# Altium schematic sheet BACKUP_POWER_充电升压俩芯片.SchDoc
size A4
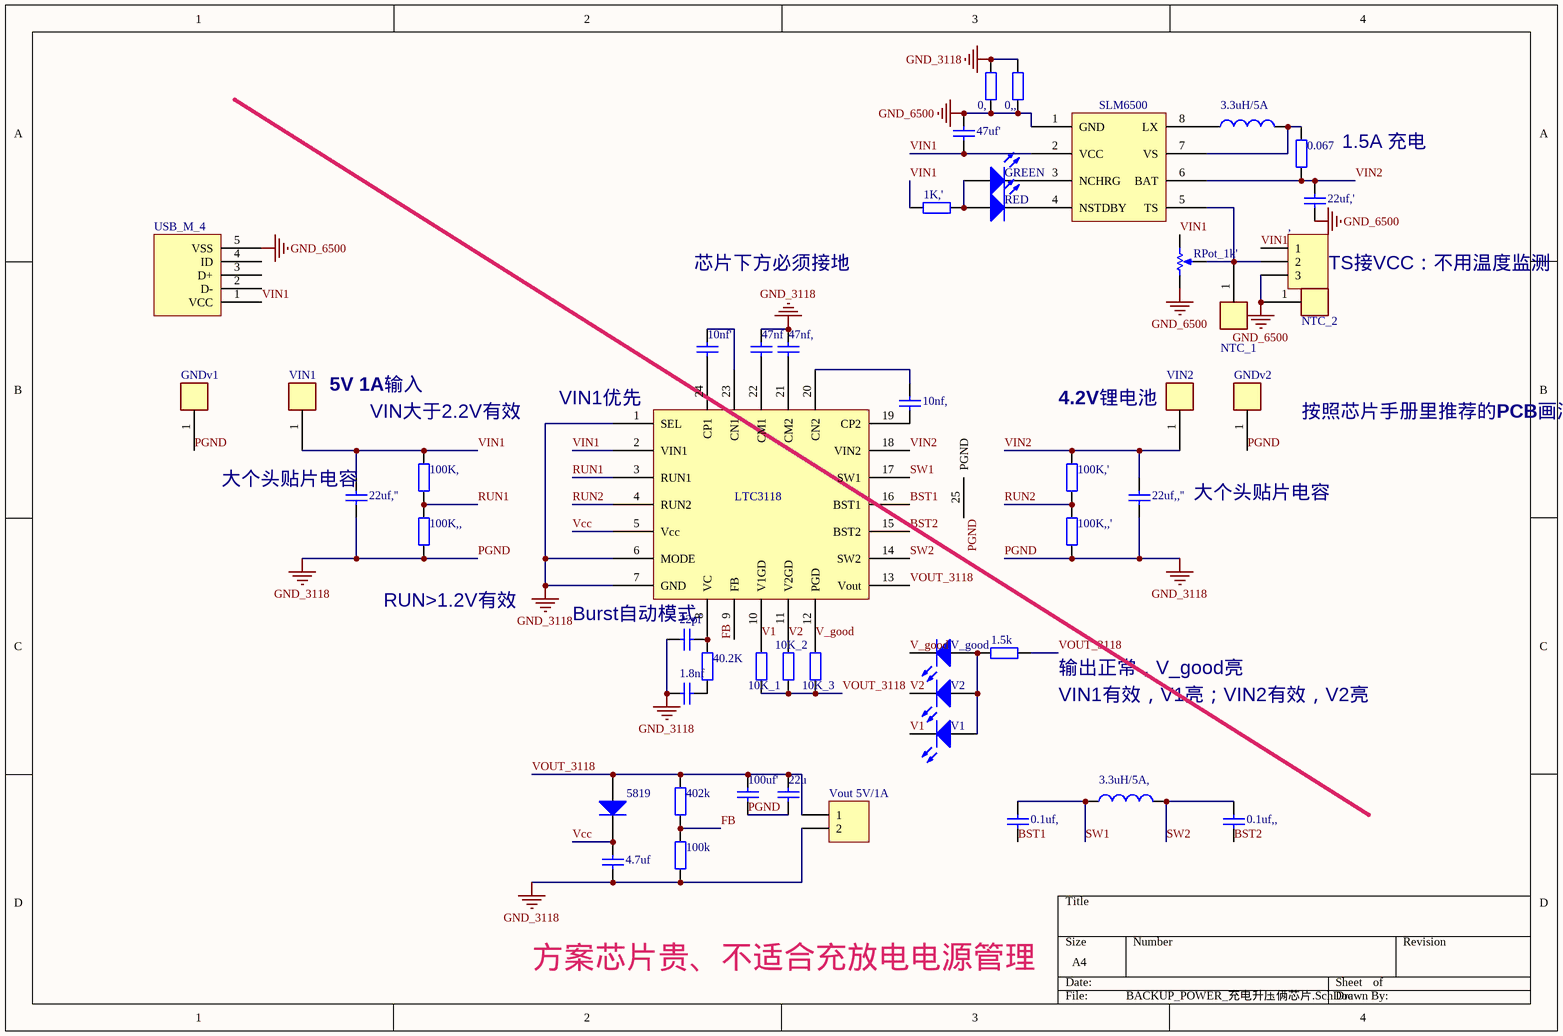
[diagram p0: BACKUP_POWER_充电升压俩芯片.SchDoc]

## Parts
0,  Res2  [0805A]  (value not drawn)
0,,  Res2  [0805A]  (value not drawn)
0.1uf,  Cap  [C-RAD-0805]  (value not drawn)
0.1uf,,  Cap  [C-RAD-0805]  (value not drawn)
0.067  Res2  [1206R]  (value not drawn)
1.5k  Res2  [0805A]  (value not drawn)
1.8nf  Cap  [C-RAD-0805]  (value not drawn)
1K,'  Res2  [0805A]  (value not drawn)
3.3uH/5A  Inductor  [6 X 6-L]  (value not drawn)
3.3uH/5A,  Inductor  [6 X 6-L]  (value not drawn)
4.7uf  Cap  [C-RAD-0805]  (value not drawn)
10K_1  Res2  [0805A]  (value not drawn)
10K_2  Res2  [0805A]  (value not drawn)
10K_3  Res2  [0805A]  (value not drawn)
10nf'  Cap  [C-RAD-0805]  (value not drawn)
10nf,  Cap  [C-RAD-0805]  (value not drawn)
22pf  Cap  [C-RAD-0805]  (value not drawn)
22u  Cap  [1812]  (value not drawn)
22uf,'  Cap  [C-RAD-0805]  (value not drawn)
22uf,''  Cap  [1812]  (value not drawn)
22uf,,''  Cap  [1812]  (value not drawn)
40.2K  Res2  [0805A]  (value not drawn)
47nf  Cap  [C-RAD-0805]  (value not drawn)
47nf,  Cap  [C-RAD-0805]  (value not drawn)
47uf'  Cap  [1812]  (value not drawn)
100k  Res2  [0805A]  (value not drawn)
100K,  Res2  [0805A]  (value not drawn)
100K,'  Res2  [0805A]  (value not drawn)
100K,,  Res2  [0805A]  (value not drawn)
100K,,'  Res2  [0805A]  (value not drawn)
100uf'  Cap  [CAP-7343]  (value not drawn)
402k  Res2  [0805A]  (value not drawn)
5819  Diode  [DIODE-1206]  (value not drawn)
,  Header 3  [HDR1X3]  (value not drawn)
GNDv1  1PIN  [PIN1]  (value not drawn)
GNDv2  1PIN  [PIN1]  (value not drawn)
GREEN  LED0  [LED_0805]  (value not drawn)
LTC3118  LTC3118 UFD/QFN24  (value not drawn)
NTC_1  1PIN  [PIN1]  (value not drawn)
NTC_2  1PIN  [PIN1]  (value not drawn)
RED  LED0  [LED_0805]  (value not drawn)
RPot_1k'  RPot  [VR_A1]  (value not drawn)
SLM6500  SLM6500  [SOP8]  (value not drawn)
USB_M_4  USB_M  [USB_MICRO]  (value not drawn)
V1  LED0  [LED_0805]  (value not drawn)
V2  LED0  [LED_0805]  (value not drawn)
V_good  LED0  [LED_0805]  (value not drawn)
VIN1  1PIN  [PIN1]  (value not drawn)
VIN2  1PIN  [PIN1]  (value not drawn)
Vout_5V/1A  Header 2  [HDR1X2]  (value not drawn)

## Nets
GND_6500: 0,.1 0,,.1 22uf,'.1 47uf'.2 ,.3 NTC_2.1 RPot_1k'.1(TOP) SLM6500.1(GND) USB_M_4.5(VSS)
PGND: 0,.2 0,,.2 1.8nf.1 4.7uf.2 22pf.1 22u.2 22uf,''.2 22uf,,''.2 47nf.1 47nf,.1 100k.1 100K,,.1 100K,,'.1 100uf'.2 GNDv1.1 GNDv2.1 LTC3118.1(SEL) LTC3118.6(MODE) LTC3118.7(GND) LTC3118.25(PGND) Vout_5V/1A.2  [also labelled GND_3118]
BST1: 0.1uf,.1 LTC3118.16(BST1)
BST2: 0.1uf,,.1 LTC3118.15(BST2)
FB: 100k.2 402k.1 LTC3118.9(FB)
RUN1: 100K,.1 100K,,.2 LTC3118.3(RUN1)
RUN2: 100K,'.1 100K,,'.2 LTC3118.4(RUN2)
SW1: 0.1uf,.2 3.3uH/5A,.1 LTC3118.17(SW1)
SW2: 0.1uf,,.2 3.3uH/5A,.2 LTC3118.14(SW2)
V1: 10K_1.2 LTC3118.10(V1GD) V1.2(K)
V2: 10K_2.2 LTC3118.11(V2GD) V2.2(K)
V_good: 10K_3.2 LTC3118.12(PGD) V_good.2(K)
Vcc: 4.7uf.1 5819.2(K) LTC3118.5(Vcc)
VIN1: 1K,'.1 22uf,''.1 47uf'.1 100K,.2 ,.1 LTC3118.2(VIN1) RPot_1k'.3(BOT) SLM6500.2(VCC) USB_M_4.1(VCC) VIN1.1
VIN2: 0.067.1 22uf,'.2 22uf,,''.1 100K,'.2 LTC3118.18(VIN2) SLM6500.6(BAT) VIN2.1
VOUT_3118: 1.5k.1 10K_1.1 10K_2.1 10K_3.1 22u.1 100uf'.1 402k.2 5819.1(A) LTC3118.13(Vout) Vout_5V/1A.1
Net0.067_2: 0.067.2 3.3uH/5A.2 SLM6500.7(VS)
Net1.5k_2: 1.5k.2 V1.1(A) V2.1(A) V_good.1(A)
Net1.8nf_2: 1.8nf.2 40.2K.1
Net1K,'_2: 1K,'.2 GREEN.1(A) RED.1(A)
Net3.3uH/5A_1: 3.3uH/5A.1 SLM6500.8(LX)
Net10nf'_1: 10nf'.1 LTC3118.23(CN1)
Net10nf'_2: 10nf'.2 LTC3118.24(CP1)
Net10nf,_1: 10nf,.1 LTC3118.19(CP2)
Net10nf,_2: 10nf,.2 LTC3118.20(CN2)
Net22pf_2: 22pf.2 40.2K.2 LTC3118.8(VC)
Net47nf,_2: 47nf,.2 LTC3118.21(CM2)
Net47nf_2: 47nf.2 LTC3118.22(CM1)
Net,_2: ,.2 NTC_1.1 RPot_1k'.2(TAP) SLM6500.5(TS)
NetGREEN_2: GREEN.2(K) SLM6500.3(NCHRG)
NetRED_2: RED.2(K) SLM6500.4(NSTDBY)

Not connected (* = marked no-connect by the designer): USB_M_4 2(D-) 3(D+) 4(ID)

## Notes on the sheet
- 1.5A 充电
- 芯片下方必须接地
- TS接VCC：不用温度监测
- (near VIN1) 5V 1A输入
- (near 100K,) VIN大于2.2V有效
- (near LTC3118) VIN1优先
- 4.2V锂电池
- 按照芯片手册里推荐的PCB画法
- 大个头贴片电容
- (near 100K,,) RUN>1.2V有效
- (near LTC3118) Burst自动模式
- (near 1.5k) VIN1有效，V1亮；VIN2有效，V2亮
- (near 1.5k) 输出正常，V_good亮
- 方案芯片贵、不适合充放电电源管理

## Library data of the parts
0, 0,, 0.067 1.5k 1K,' 10K_1-10K_3 40.2K 100k 100K, 100K,' 100K,, 100K,,' 402k = Res2: Resistor; Value: 1K; Published: 8-Jun-2000; LatestRevisionDate: 17-Jul-2002; LatestRevisionNote: Re-released for DXP Platform.; PackageReference: AXIAL-0.4; Publisher: Altium Limited; PackageDescription: Axial Device, Thru-Hole; 2 Leads; 0.4 in Pin Spacing
0.1uf, 0.1uf,, 1.8nf 4.7uf 10nf' 10nf, 22pf 22u 22uf,' 22uf,'' 22uf,,'' 47nf 47nf, 47uf' 100uf' = Cap: Capacitor; Value: 0.1uF; Published: 8-Jun-2000; LatestRevisionDate: 17-Jul-2002; LatestRevisionNote: Re-released for DXP Platform.; PackageReference: RAD-0.3; Publisher: Altium Limited; PackageDescription: Radial Cap, Thru-Hole; 2 Leads; 0.3 in Pin Spacing
3.3uH/5A 3.3uH/5A, = Inductor: Code_IEC: 1005; Published: 8-Jun-2000; LatestRevisionDate: 29-May-2009; LatestRevisionNote: IPC-7351 Footprint Added.; PackageReference: 0402-A; Publisher: Altium Limited; PackageDescription: Chip Inductor; Code_JEITA: 0402
5819 = Diode: 二极管; Published: 8-Jun-2000; LatestRevisionDate: 17-Jul-2002; LatestRevisionNote: Re-released for DXP Platform.; PackageDocument: Sep-1996; PackageReference: SMC; Publisher: Altium Limited; Code_JEDEC: DO-214-AB; Type: 1N4001
, = Header 3: Header, 3-Pin; LatestRevisionDate: 17-Jul-2002; LatestRevisionNote: Re-released for DXP Platform.; Publisher: Altium Limited
GREEN RED V1 V2 V_good = LED0: 发光二极管; Published: 8-Jun-2000; LatestRevisionDate: 08-Jul-2005; LatestRevisionNote: Mech Layer 1 removed.; PackageReference: LED-0; Publisher: Altium Limited
RPot_1k' = RPot: 精密可调电阻; Sim Note: Enter the Resistance value and the set point into parameter fields.; Set Position: 0.5; Published: 8-Jun-2000; LatestRevisionDate: 17-Jul-2002; LatestRevisionNote: Re-released for DXP Platform.; PackageReference: VR5; Publisher: Altium Limited
USB_M_4 = USB_M: MicroUSB接口
Vout_5V/1A = Header 2: Header, 2-Pin; LatestRevisionDate: 17-Jul-2002; LatestRevisionNote: Re-released for DXP Platform.; Publisher: Altium Limited